# Altium schematic sheet Debug.SchDoc
size A; SheetNumber: 6; SheetTotal: 6
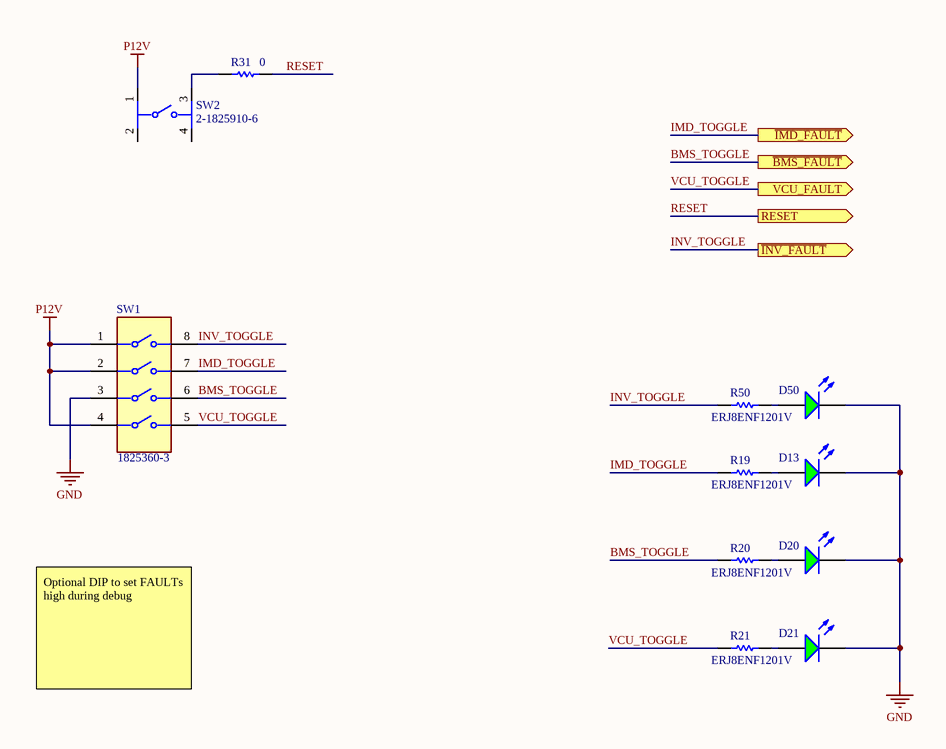
[diagram p0: Debug.SchDoc]

## Parts
D13  597-3311-407F  [DIAL-597-3311-407F_V]  (value not drawn)
D20  597-3311-407F  [DIAL-597-3311-407F_V]  (value not drawn)
D21  597-3311-407F  [DIAL-597-3311-407F_V]  (value not drawn)
D50  597-3311-407F  [DIAL-597-3311-407F_V]  (value not drawn)
R19  ERJ8ENF1201V  [RESC3216X70X50LL05T20]
R20  ERJ8ENF1201V  [RESC3216X70X50LL05T20]
R21  ERJ8ENF1201V  [RESC3216X70X50LL05T20]
R31  value 0  [RESC3216X60X45ML15T20]  (hidden comment: Resistor 0R +/- 5% 1206 250 mW)
R50  ERJ8ENF1201V  [RESC3216X70X50LL05T20]
SW1  1825360-3  [FP-1825360-3-MFG]
SW2  2-1825910-6  [FP-2-1825910-6-MFG]

## Ports
RESET (out), VCU_FAULT (out), ~{BMS_FAULT} (out), ~{IMD_FAULT} (out), ~{INV_FAULT} (out)

## Nets
GND: D13.2(K) D20.2(K) D21.2(K) D50.2(K) SW1.3
P12V: SW1.1 SW1.2 SW1.4 SW2.1
BMS_TOGGLE: R20.1 SW1.6 ; port ~{BMS_FAULT}
IMD_TOGGLE: R19.1 SW1.7 ; port ~{IMD_FAULT}
INV_TOGGLE: R50.1 SW1.8 ; port ~{INV_FAULT}
RESET: R31.2 ; port RESET
VCU_TOGGLE: R21.1 SW1.5 ; port VCU_FAULT
NetD13_1: D13.1(A) R19.2
NetD20_1: D20.1(A) R20.2
NetD21_1: D21.1(A) R21.2
NetD50_1: D50.1(A) R50.2
NetR31_1: R31.1 SW2.3

Not connected (* = marked no-connect by the designer): SW2 2 4

## Notes on the sheet
- Optional DIP to set FAULTs high during debug

## Library data of the parts
D13 D20 D21 D50 = CMP-2000-05651-1: LED Green, 75 mW, 30 mA, -30 to 85 degC, 2-Pin SMD, RoHS, Tape and Reel; Manufacturer: Dialight; Product Depth (mm): 1.5mm; Viewing Angle: 70deg; DELETED: Compliant; Number of  Elements: 1; Emitting Color: YellowGreen; Shape Type: Rectangular; Product Length (mm): 3mm; Forward Current: 30mA; Main Category: ChipLED; Luminous Intensity: 7.5mcd; Type: Uni-Color; High Brightness: No; Test Current (It): 20mA; Lens Type: NonDiffused; Reverse Voltage: 4V; Peak Wavelength: 560nm; Power Dissipation: 75W; Forward Voltage: 2.5V; Chip Material: GaP; Mounting: SurfaceMount; Product Height (mm): 1.5mm; Pin Count: 2; Datasheet URL: https://datasheet.ciiva.com/15117/getdatasheetpartid-142484-15117764.pdf; Mounting Technology: SurfaceMount; Rad Hardened: No; Operating Temperature Classification: Commercial; Lens Dimensions: 2x1.5x0.9mm; Operating Temp Range: -30Cto85C; Package Reference: 597-3311-407F; Package Type: SMD; Datasheet Version: 07/2002; Lum Intensity: 7.5mcd; Packaging: TapeandReel; Package Description: 2-Pin Surface Mount Device, Body 1.5 x 3 mm; Manufacturer URL: http://www.dialight.com/
R19-R21 R50 = CMP-2003-00061-1: Manufacturer: Panasonic; Part Number: ERJ8ENF1201V
R31 = CMP-009-00002-4: Chip Resistor, 0 Ohm, +/- 5%, 0.25 W, -55 to 155 degC, 1206 (3216 Metric); Voltage Rating: 200V; Power: 250mW; Case/Package: 1206; Mounting Technology: SM; RoHS Compliant: True; Min Operating Temperature: -55°C; Max Operating Temperature: 155°C; Tolerance: 5%; Pins: 2
SW1 = CMP-03400-000022-1: SWITCH SLIDE DIP SPST 100MA 24V; Washable: Yes; Contact Current Rating: 1A; Electrical Life: 1000Cycles; Number of Circuits: 4; Pitch: 0.1inch; Actuator Length: 0.99mm; Contact Resistance: 50mR; Actuator Type: Standard; Contact Post Length: 4mm; Voltage Rating (DC): 5V; Actuator Material: Polybutylene; Sealable: No (Without); Max Voltage Rating (DC): 24V; Throw Configuration: SPST; Mount: Through Hole; Type: Switch; RoHS Compliant: Yes; Min Operating Temperature: -30°C; Max Operating Temperature: 85°C; Orientation: Straight; Packaging: Rail/Tube; Series: ADE; Lead Free: Lead Free; Depth: 7.49mm; Flammability Rating: UL94 V-0; Radiation Hardening: No; Terminal Pitch: 2.54mm; Package Quantity: 35; Contact Material: Copper Alloy; Housing Color: Black; Number of Positions: 4; Length: 0.476inch; ELV: Compliant; Termination: PC Pins; Housing Material: Polyphenylene; Contact Plating: Gold; Max Current Rating: 100mA; Height: 0.138inch
SW2 = CMP-03407-000025-1: SWITCH TACTILE SPST-NO 0.05A 24V; Max Current Rating: 50mA; Actuator Type: Standard; Illumination Type: Non-Illuminated; Actuator Material: Nylon; Throw Configuration: SPST; Actuator Length: 0.37inch; Operating Force: 100gf; Switch Function: Off-Mom; Mechanical Life: 100000Cycles; Actuator Color: Brown; Switch Travel: 0.25mm; Packaging: Loose Piece; Series: FSMJ; RoHS Compliant: Yes; Mount: Through Hole; Lead Free: Lead Free; Length: 5.99mm; Voltage Rating (DC): 24V; Type: Switch; Contact Current Rating: 50mA; Contact Material: Copper Alloy; Max Operating Temperature: 85°C; Min Operating Temperature: -35°C; Termination: PC Pin; ELV: Compliant; Orientation: Straight; Contact Plating: Silver